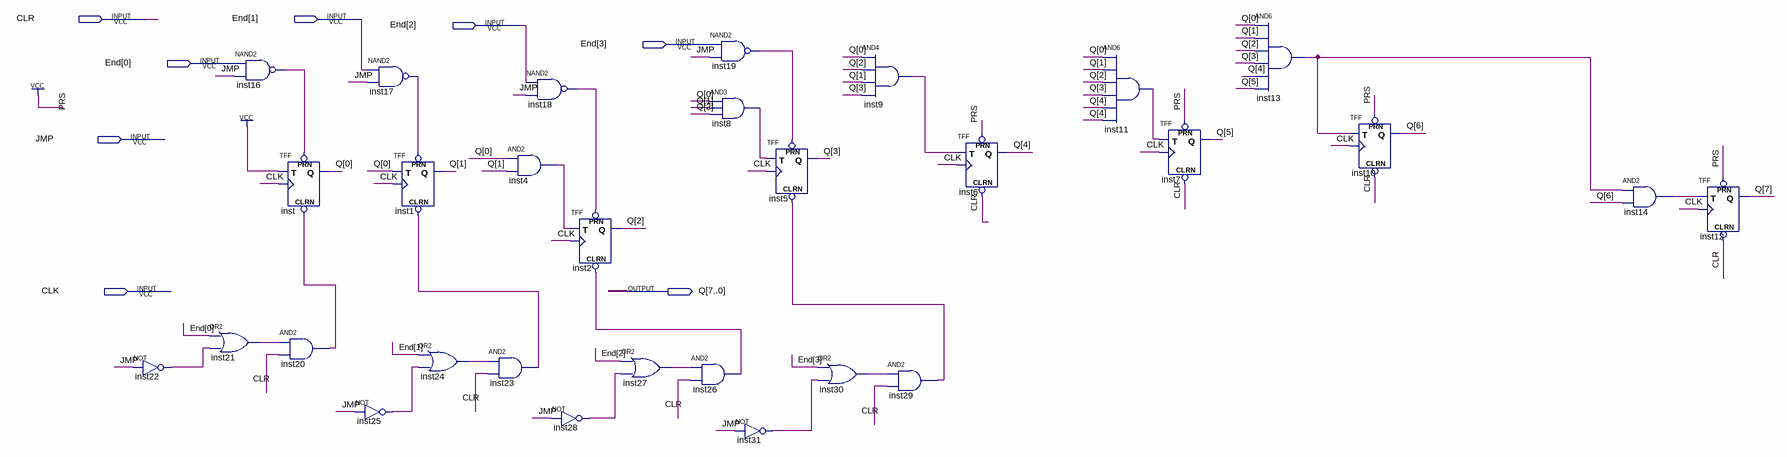
[diagram p0: schematic sheet]
// Quartus schematic counter.bdf as structural Verilog: 30 symbols, 8 pins
module counter (
  input  CLR,
  input  [3:0] End,
  input  JMP,
  input  CLK,
  output [7:0] Q
);

  wire inst4_out, inst8_out, inst9_out, inst11_out, inst13_out, inst14_out, inst16_out, inst17_out,
       inst18_out, inst19_out, inst20_out, inst21_out, inst22_out, inst23_out, inst24_out, inst25_out,
       inst26_out, inst27_out, inst28_out, inst29_out, inst30_out, inst31_out;

  not inst22 (inst22_out, JMP);
  nand inst16 (inst16_out, End[0], JMP);
  or inst21 (inst21_out, End[0], inst22_out);
  TFF inst (.PRN(inst16_out), .CLRN(inst20_out), .T(1'b1), .CLK(CLK), .Q(Q[0]));
  and inst20 (inst20_out, inst21_out, CLR);
  not inst25 (inst25_out, JMP);
  nand inst17 (inst17_out, End[1], JMP);
  TFF inst1 (.PRN(inst17_out), .CLRN(inst23_out), .T(Q[0]), .CLK(CLK), .Q(Q[1]));
  or inst24 (inst24_out, End[1], inst25_out);
  and inst4 (inst4_out, Q[0], Q[1]);
  and inst23 (inst23_out, inst24_out, CLR);
  nand inst18 (inst18_out, End[2], JMP);
  not inst28 (inst28_out, JMP);
  TFF inst2 (.PRN(inst18_out), .CLRN(inst26_out), .T(inst4_out), .CLK(CLK), .Q(Q[2]));
  or inst27 (inst27_out, End[2], inst28_out);
  nand inst19 (inst19_out, End[3], JMP);
  and inst8 (inst8_out, Q[0], Q[1], Q[2]);
  and inst26 (inst26_out, inst27_out, CLR);
  not inst31 (inst31_out, JMP);
  TFF inst5 (.PRN(inst19_out), .CLRN(inst29_out), .T(inst8_out), .CLK(CLK), .Q(Q[3]));
  and inst9 (inst9_out, Q[0], Q[2], Q[1], Q[3]);
  or inst30 (inst30_out, End[3], inst31_out);
  and inst29 (inst29_out, inst30_out, CLR);
  TFF inst6 (.PRN(1'b1), .CLRN(CLR), .T(inst9_out), .CLK(CLK), .Q(Q[4]));
  and inst11 (inst11_out, Q[0], Q[1], Q[2], Q[3], Q[4], Q[4]);
  TFF inst7 (.PRN(1'b1), .CLRN(CLR), .T(inst11_out), .CLK(CLK), .Q(Q[5]));
  and inst13 (inst13_out, Q[0], Q[1], Q[2], Q[3], Q[4], Q[5]);
  TFF inst10 (.PRN(1'b1), .CLRN(CLR), .T(inst13_out), .CLK(CLK), .Q(Q[6]));
  and inst14 (inst14_out, inst13_out, Q[6]);
  TFF inst12 (.PRN(1'b1), .CLRN(CLR), .T(inst14_out), .CLK(CLK), .Q(Q[7]));
endmodule
